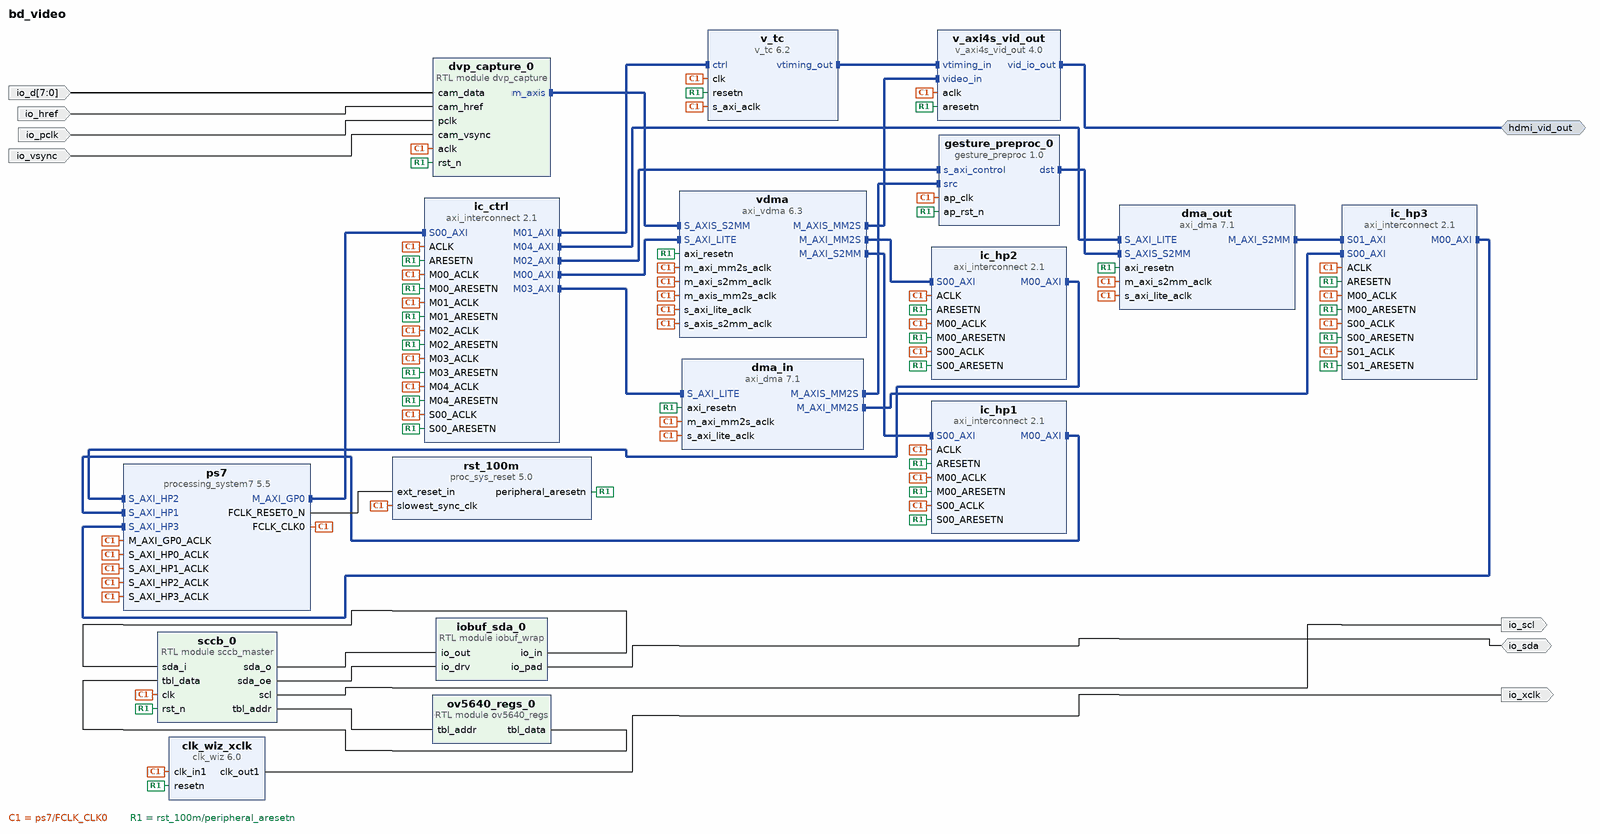
[diagram p0: block diagram of the top level]
# Vivado block design bd_video, xc7z020clg400-1, Vivado 2025.2
create_bd_design bd_video

create_bd_intf_port -mode Master -vlnv xilinx.com:interface:vid_io_rtl:1.0 hdmi_vid_out
create_bd_port -dir I -type clk io_pclk
set_property -dict {CONFIG.FREQ_HZ 24000000} [get_bd_ports io_pclk]
create_bd_port -dir I io_vsync
create_bd_port -dir I io_href
create_bd_port -dir I -from 7 -to 0 io_d
create_bd_port -dir O io_xclk
create_bd_port -dir O io_scl
create_bd_port -dir IO io_sda

create_bd_cell -type ip -vlnv xilinx.com:ip:processing_system7:5.5 ps7
set_property -dict [list \
  CONFIG.PCW_FPGA0_PERIPHERAL_FREQMHZ 100 \
  CONFIG.PCW_UIPARAM_DDR_FREQ_MHZ 533.333 \
  CONFIG.PCW_UIPARAM_DDR_PARTNO {MT41K256M16 RE-125} \
  CONFIG.PCW_USE_S_AXI_HP0 1 \
  CONFIG.PCW_USE_S_AXI_HP1 1 \
  CONFIG.PCW_USE_S_AXI_HP2 1 \
  CONFIG.PCW_USE_S_AXI_HP3 1 \
] [get_bd_cells ps7]
# 36 more settings of ps7 are not shown: defaults, MIO pin electricals, DDR timing, and values the tool derives
create_bd_cell -type ip -vlnv xilinx.com:ip:proc_sys_reset:5.0 rst_100m
create_bd_cell -type ip -vlnv xilinx.com:ip:axi_vdma:6.3 vdma
set_property -dict [list \
  CONFIG.c_include_mm2s 1 \
  CONFIG.c_include_s2mm 1 \
  CONFIG.c_include_sg 0 \
  CONFIG.c_m_axi_mm2s_data_width 64 \
  CONFIG.c_m_axi_s2mm_data_width 64 \
  CONFIG.c_m_axis_mm2s_tdata_width 16 \
  CONFIG.c_mm2s_genlock_mode 0 \
  CONFIG.c_mm2s_linebuffer_depth 2048 \
  CONFIG.c_num_fstores 3 \
  CONFIG.c_s2mm_genlock_mode 0 \
  CONFIG.c_s2mm_linebuffer_depth 2048 \
] [get_bd_cells vdma]
create_bd_cell -type ip -vlnv xilinx.com:ip:v_tc:6.2 v_tc
set_property -dict {CONFIG.VIDEO_MODE 480p CONFIG.enable_detection false} [get_bd_cells v_tc]
create_bd_cell -type ip -vlnv xilinx.com:ip:v_axi4s_vid_out:4.0 v_axi4s_vid_out
set_property -dict [list \
  CONFIG.C_ADDR_WIDTH 11 \
  CONFIG.C_HAS_ASYNC_CLK 0 \
  CONFIG.C_S_AXIS_VIDEO_DATA_WIDTH 8 \
  CONFIG.C_S_AXIS_VIDEO_FORMAT 0 \
] [get_bd_cells v_axi4s_vid_out]
create_bd_cell -type module -reference dvp_capture dvp_capture_0
create_bd_cell -type ip -vlnv xilinx.com:ip:clk_wiz:6.0 clk_wiz_xclk
set_property -dict [list \
  CONFIG.CLKOUT1_REQUESTED_OUT_FREQ 24.000 \
  CONFIG.MMCM_CLKFBOUT_MULT_F 6.000 \
  CONFIG.MMCM_CLKOUT0_DIVIDE_F 25.000 \
  CONFIG.MMCM_DIVCLK_DIVIDE 1 \
  CONFIG.OVERRIDE_MMCM true \
  CONFIG.PRIMITIVE MMCM \
  CONFIG.PRIM_IN_FREQ 100.000 \
  CONFIG.RESET_TYPE ACTIVE_LOW \
  CONFIG.USE_LOCKED true \
  CONFIG.USE_RESET true \
] [get_bd_cells clk_wiz_xclk]
create_bd_cell -type module -reference sccb_master sccb_0
set_property -dict {CONFIG.N_REGS 250} [get_bd_cells sccb_0]
create_bd_cell -type module -reference ov5640_regs ov5640_regs_0
create_bd_cell -type module -reference iobuf_wrap iobuf_sda_0
create_bd_cell -type ip -vlnv user:hls:gesture_preproc:1.0 gesture_preproc_0
create_bd_cell -type ip -vlnv xilinx.com:ip:axi_dma:7.1 dma_in
set_property -dict [list \
  CONFIG.c_include_mm2s 1 \
  CONFIG.c_include_s2mm 0 \
  CONFIG.c_include_sg 0 \
  CONFIG.c_m_axi_mm2s_data_width 32 \
  CONFIG.c_m_axis_mm2s_tdata_width 16 \
  CONFIG.c_mm2s_burst_size 64 \
  CONFIG.c_sg_length_width 24 \
] [get_bd_cells dma_in]
create_bd_cell -type ip -vlnv xilinx.com:ip:axi_dma:7.1 dma_out
set_property -dict [list \
  CONFIG.c_include_mm2s 0 \
  CONFIG.c_include_s2mm 1 \
  CONFIG.c_include_sg 0 \
  CONFIG.c_m_axi_s2mm_data_width 32 \
  CONFIG.c_s2mm_burst_size 64 \
  CONFIG.c_s_axis_s2mm_tdata_width 8 \
  CONFIG.c_sg_length_width 24 \
] [get_bd_cells dma_out]
create_bd_cell -type ip -vlnv xilinx.com:ip:axi_interconnect:2.1 ic_ctrl
set_property -dict {CONFIG.NUM_MI 5 CONFIG.NUM_SI 1} [get_bd_cells ic_ctrl]
create_bd_cell -type ip -vlnv xilinx.com:ip:axi_interconnect:2.1 ic_hp1
set_property -dict {CONFIG.NUM_MI 1 CONFIG.NUM_SI 1} [get_bd_cells ic_hp1]
create_bd_cell -type ip -vlnv xilinx.com:ip:axi_interconnect:2.1 ic_hp2
set_property -dict {CONFIG.NUM_MI 1 CONFIG.NUM_SI 1} [get_bd_cells ic_hp2]
create_bd_cell -type ip -vlnv xilinx.com:ip:axi_interconnect:2.1 ic_hp3
set_property -dict {CONFIG.NUM_MI 1 CONFIG.NUM_SI 2} [get_bd_cells ic_hp3]

# ---- connections ----

connect_bd_intf_net [get_bd_intf_pins dma_in/M_AXIS_MM2S] [get_bd_intf_pins gesture_preproc_0/src]
connect_bd_intf_net [get_bd_intf_pins dma_in/M_AXI_MM2S] [get_bd_intf_pins ic_hp3/S00_AXI]
connect_bd_intf_net [get_bd_intf_pins dma_out/M_AXI_S2MM] [get_bd_intf_pins ic_hp3/S01_AXI]
connect_bd_intf_net [get_bd_intf_pins dvp_capture_0/m_axis] [get_bd_intf_pins vdma/S_AXIS_S2MM]
connect_bd_intf_net [get_bd_intf_pins gesture_preproc_0/dst] [get_bd_intf_pins dma_out/S_AXIS_S2MM]
connect_bd_intf_net [get_bd_intf_pins ic_ctrl/M00_AXI] [get_bd_intf_pins vdma/S_AXI_LITE]
connect_bd_intf_net [get_bd_intf_pins ic_ctrl/M01_AXI] [get_bd_intf_pins v_tc/ctrl]
connect_bd_intf_net [get_bd_intf_pins ic_ctrl/M02_AXI] [get_bd_intf_pins gesture_preproc_0/s_axi_control]
connect_bd_intf_net [get_bd_intf_pins ic_ctrl/M03_AXI] [get_bd_intf_pins dma_in/S_AXI_LITE]
connect_bd_intf_net [get_bd_intf_pins ic_ctrl/M04_AXI] [get_bd_intf_pins dma_out/S_AXI_LITE]
connect_bd_intf_net [get_bd_intf_pins ic_hp1/M00_AXI] [get_bd_intf_pins ps7/S_AXI_HP1]
connect_bd_intf_net [get_bd_intf_pins ic_hp2/M00_AXI] [get_bd_intf_pins ps7/S_AXI_HP2]
connect_bd_intf_net [get_bd_intf_pins ic_hp3/M00_AXI] [get_bd_intf_pins ps7/S_AXI_HP3]
connect_bd_intf_net [get_bd_intf_pins ps7/M_AXI_GP0] [get_bd_intf_pins ic_ctrl/S00_AXI]
connect_bd_intf_net [get_bd_intf_ports hdmi_vid_out] [get_bd_intf_pins v_axi4s_vid_out/vid_io_out]
connect_bd_intf_net [get_bd_intf_pins v_tc/vtiming_out] [get_bd_intf_pins v_axi4s_vid_out/vtiming_in]
connect_bd_intf_net [get_bd_intf_pins vdma/M_AXIS_MM2S] [get_bd_intf_pins v_axi4s_vid_out/video_in]
connect_bd_intf_net [get_bd_intf_pins vdma/M_AXI_MM2S] [get_bd_intf_pins ic_hp2/S00_AXI]
connect_bd_intf_net [get_bd_intf_pins vdma/M_AXI_S2MM] [get_bd_intf_pins ic_hp1/S00_AXI]
connect_bd_net [get_bd_ports io_sda] [get_bd_pins iobuf_sda_0/io_pad]
connect_bd_net [get_bd_pins clk_wiz_xclk/clk_out1] [get_bd_ports io_xclk]
connect_bd_net [get_bd_ports io_d] [get_bd_pins dvp_capture_0/cam_data]
connect_bd_net [get_bd_ports io_href] [get_bd_pins dvp_capture_0/cam_href]
connect_bd_net [get_bd_ports io_pclk] [get_bd_pins dvp_capture_0/pclk]
connect_bd_net [get_bd_ports io_vsync] [get_bd_pins dvp_capture_0/cam_vsync]
connect_bd_net [get_bd_pins iobuf_sda_0/io_in] [get_bd_pins sccb_0/sda_i]
connect_bd_net [get_bd_pins ov5640_regs_0/tbl_data] [get_bd_pins sccb_0/tbl_data]
connect_bd_net [get_bd_pins ps7/FCLK_CLK0] \
  [get_bd_pins rst_100m/slowest_sync_clk] [get_bd_pins ps7/M_AXI_GP0_ACLK] [get_bd_pins ps7/S_AXI_HP0_ACLK] \
  [get_bd_pins ps7/S_AXI_HP1_ACLK] [get_bd_pins ps7/S_AXI_HP2_ACLK] [get_bd_pins ic_ctrl/ACLK] [get_bd_pins ic_ctrl/S00_ACLK] \
  [get_bd_pins ic_ctrl/M00_ACLK] [get_bd_pins ic_ctrl/M01_ACLK] [get_bd_pins ic_ctrl/M02_ACLK] [get_bd_pins ic_ctrl/M03_ACLK] \
  [get_bd_pins ic_ctrl/M04_ACLK] [get_bd_pins ic_hp1/ACLK] [get_bd_pins ic_hp1/S00_ACLK] [get_bd_pins ic_hp1/M00_ACLK] \
  [get_bd_pins ic_hp2/ACLK] [get_bd_pins ic_hp2/S00_ACLK] [get_bd_pins ic_hp2/M00_ACLK] [get_bd_pins ic_hp3/ACLK] \
  [get_bd_pins ic_hp3/S00_ACLK] [get_bd_pins ic_hp3/S01_ACLK] [get_bd_pins ic_hp3/M00_ACLK] [get_bd_pins ps7/S_AXI_HP3_ACLK] \
  [get_bd_pins vdma/s_axi_lite_aclk] [get_bd_pins vdma/m_axi_mm2s_aclk] [get_bd_pins vdma/m_axi_s2mm_aclk] \
  [get_bd_pins vdma/s_axis_s2mm_aclk] [get_bd_pins vdma/m_axis_mm2s_aclk] [get_bd_pins v_tc/clk] \
  [get_bd_pins v_tc/s_axi_aclk] [get_bd_pins v_axi4s_vid_out/aclk] [get_bd_pins dvp_capture_0/aclk] \
  [get_bd_pins clk_wiz_xclk/clk_in1] [get_bd_pins sccb_0/clk] [get_bd_pins gesture_preproc_0/ap_clk] \
  [get_bd_pins dma_in/s_axi_lite_aclk] [get_bd_pins dma_in/m_axi_mm2s_aclk] [get_bd_pins dma_out/s_axi_lite_aclk] \
  [get_bd_pins dma_out/m_axi_s2mm_aclk]
connect_bd_net [get_bd_pins ps7/FCLK_RESET0_N] [get_bd_pins rst_100m/ext_reset_in]
connect_bd_net [get_bd_pins rst_100m/peripheral_aresetn] \
  [get_bd_pins ic_ctrl/ARESETN] [get_bd_pins ic_ctrl/S00_ARESETN] [get_bd_pins ic_ctrl/M00_ARESETN] \
  [get_bd_pins ic_ctrl/M01_ARESETN] [get_bd_pins ic_ctrl/M02_ARESETN] [get_bd_pins ic_ctrl/M03_ARESETN] \
  [get_bd_pins ic_ctrl/M04_ARESETN] [get_bd_pins ic_hp1/ARESETN] [get_bd_pins ic_hp1/S00_ARESETN] \
  [get_bd_pins ic_hp1/M00_ARESETN] [get_bd_pins ic_hp2/ARESETN] [get_bd_pins ic_hp2/S00_ARESETN] \
  [get_bd_pins ic_hp2/M00_ARESETN] [get_bd_pins ic_hp3/ARESETN] [get_bd_pins ic_hp3/S00_ARESETN] \
  [get_bd_pins ic_hp3/S01_ARESETN] [get_bd_pins ic_hp3/M00_ARESETN] [get_bd_pins gesture_preproc_0/ap_rst_n] \
  [get_bd_pins dma_in/axi_resetn] [get_bd_pins dma_out/axi_resetn] [get_bd_pins v_tc/resetn] \
  [get_bd_pins v_axi4s_vid_out/aresetn] [get_bd_pins vdma/axi_resetn] [get_bd_pins dvp_capture_0/rst_n] \
  [get_bd_pins clk_wiz_xclk/resetn] [get_bd_pins sccb_0/rst_n]
connect_bd_net [get_bd_pins sccb_0/scl] [get_bd_ports io_scl]
connect_bd_net [get_bd_pins sccb_0/sda_o] [get_bd_pins iobuf_sda_0/io_out]
connect_bd_net [get_bd_pins sccb_0/sda_oe] [get_bd_pins iobuf_sda_0/io_drv]
connect_bd_net [get_bd_pins sccb_0/tbl_addr] [get_bd_pins ov5640_regs_0/tbl_addr]

# ---- address map ----
assign_bd_address -offset 0x00000000 -range 1G -target_address_space [get_bd_addr_spaces dma_in/Data_MM2S] [get_bd_addr_segs ps7/S_AXI_HP3/HP3_DDR_LOWOCM]
assign_bd_address -offset 0x00000000 -range 1G -target_address_space [get_bd_addr_spaces dma_out/Data_S2MM] [get_bd_addr_segs ps7/S_AXI_HP3/HP3_DDR_LOWOCM]
assign_bd_address -offset 0x40000000 -range 64K -target_address_space [get_bd_addr_spaces ps7/Data] [get_bd_addr_segs gesture_preproc_0/s_axi_control/Reg]
assign_bd_address -offset 0x41E00000 -range 64K -target_address_space [get_bd_addr_spaces ps7/Data] [get_bd_addr_segs dma_in/S_AXI_LITE/Reg]
assign_bd_address -offset 0x41E10000 -range 64K -target_address_space [get_bd_addr_spaces ps7/Data] [get_bd_addr_segs dma_out/S_AXI_LITE/Reg]
assign_bd_address -offset 0x44A00000 -range 64K -target_address_space [get_bd_addr_spaces ps7/Data] [get_bd_addr_segs v_tc/ctrl/Reg]
assign_bd_address -offset 0x44A10000 -range 64K -target_address_space [get_bd_addr_spaces ps7/Data] [get_bd_addr_segs vdma/S_AXI_LITE/Reg]
assign_bd_address -offset 0x00000000 -range 1G -target_address_space [get_bd_addr_spaces vdma/Data_MM2S] [get_bd_addr_segs ps7/S_AXI_HP2/HP2_DDR_LOWOCM]
assign_bd_address -offset 0x00000000 -range 1G -target_address_space [get_bd_addr_spaces vdma/Data_S2MM] [get_bd_addr_segs ps7/S_AXI_HP1/HP1_DDR_LOWOCM]

validate_bd_design
save_bd_design
